# Altium schematic sheet RV09-S_SCH.SchDoc
size A4; SheetNumber: 1; SheetTotal: 1
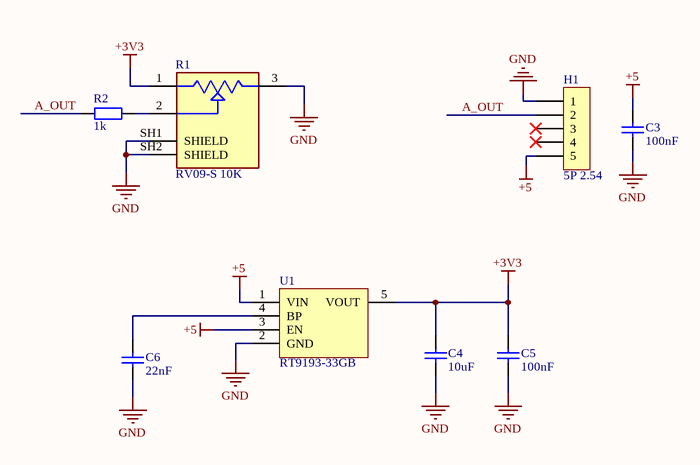
[diagram p0: RV09-S_SCH.SchDoc]

## Parts
C3  100nF  [tu 0603]
C4  10uF  [tu 0603]
C5  100nF  [tu 0603]
C6  22nF  [tu 0603]
H1  5P 2.54  [Header 5P DC 2.54]
R1  RV09-S 10K  [TRIM_RV09AF-40-20K-A10K]
R2  1k  [tro smd 0603]
U1  RT9193-33GB  [SOT23-5]

## Nets
+3V3: C4.1 C5.1 R1.1 U1.5(VOUT)
+5: C3.1 H1.5 U1.1(VIN) U1.3(EN)
GND: C3.2 C4.2 C5.2 C6.2 H1.1 R1.3 R1.SH1(SHIELD) R1.SH2(SHIELD) U1.2(GND)
A_OUT: H1.2 R2.2
NetC6_1: C6.1 U1.4(BP)
NetR1_2: R1.2 R2.1

Not connected (* = marked no-connect by the designer): H1 3* 4*

## Library data of the parts
C3 C5 C6 = Tu 0603 104 50V 10%: Dán; Don_Vi: Con; So_Chan: 2; Ten_Linh_Kien: Tụ 0603 104-100nF 10% 50V; Ma_Hang: MH004568; Chung_Loai: Dán; Kieu_Chan: *
C4 = Tu 0603 106 16V 20%: Dán; Don_Vi: Con; So_Chan: 2; Ten_Linh_Kien: Tụ 0603-10uF 20% 16V; Ma_Hang: MH004848; Chung_Loai: Dán; Kieu_Chan: *
H1 = Header 5P 2.54 Duc Cong: Cắm; Ten_Linh_Kien: Header 5P XH2.54-5P Đực Cong; Don_Vi: Con; Ma_Hang: MH001308; Chung_Loai: Cắm
R1 = RV09-S 10k: MF: Alpha Taiwan; MP: RV09AF-40-20K-A10K; SnapEDA_Link: https://www.snapeda.com/parts/RV09AF-40-20K-A10K/Alpha/view-part/?ref=snap; Package: None; Value: *; Check_prices: https://www.snapeda.com/parts/RV09AF-40-20K-A10K/Alpha/view-part/?ref=eda
R2 = Tro 0603 1% 10k: Dán; Don_Vi: Con; So_Chan: 2; Ten_Linh_Kien: Trở 0603 1% 10k; Ma_Hang: MH006333; Chung_Loai: Dán; Kieu_Chan: *
U1 = REG_5.5V-3.3V-0.3A-1W-SOT-23-5: Linear Voltage Regulator IC 1 Output 300mA SOT-23-5; Manufacturer: Richtek USA Inc.; Alternate Part Number-1: NA; Manufacturer Part Number: RT9193-33GB; Supplier-1: LCSC; Supplier Part Number-1: C15651; Case/Package: SOT-23-5